# Altium schematic sheet NZPP.SchDoc
size 420 x 297 mm; SheetNumber: 1; SheetTotal: 1
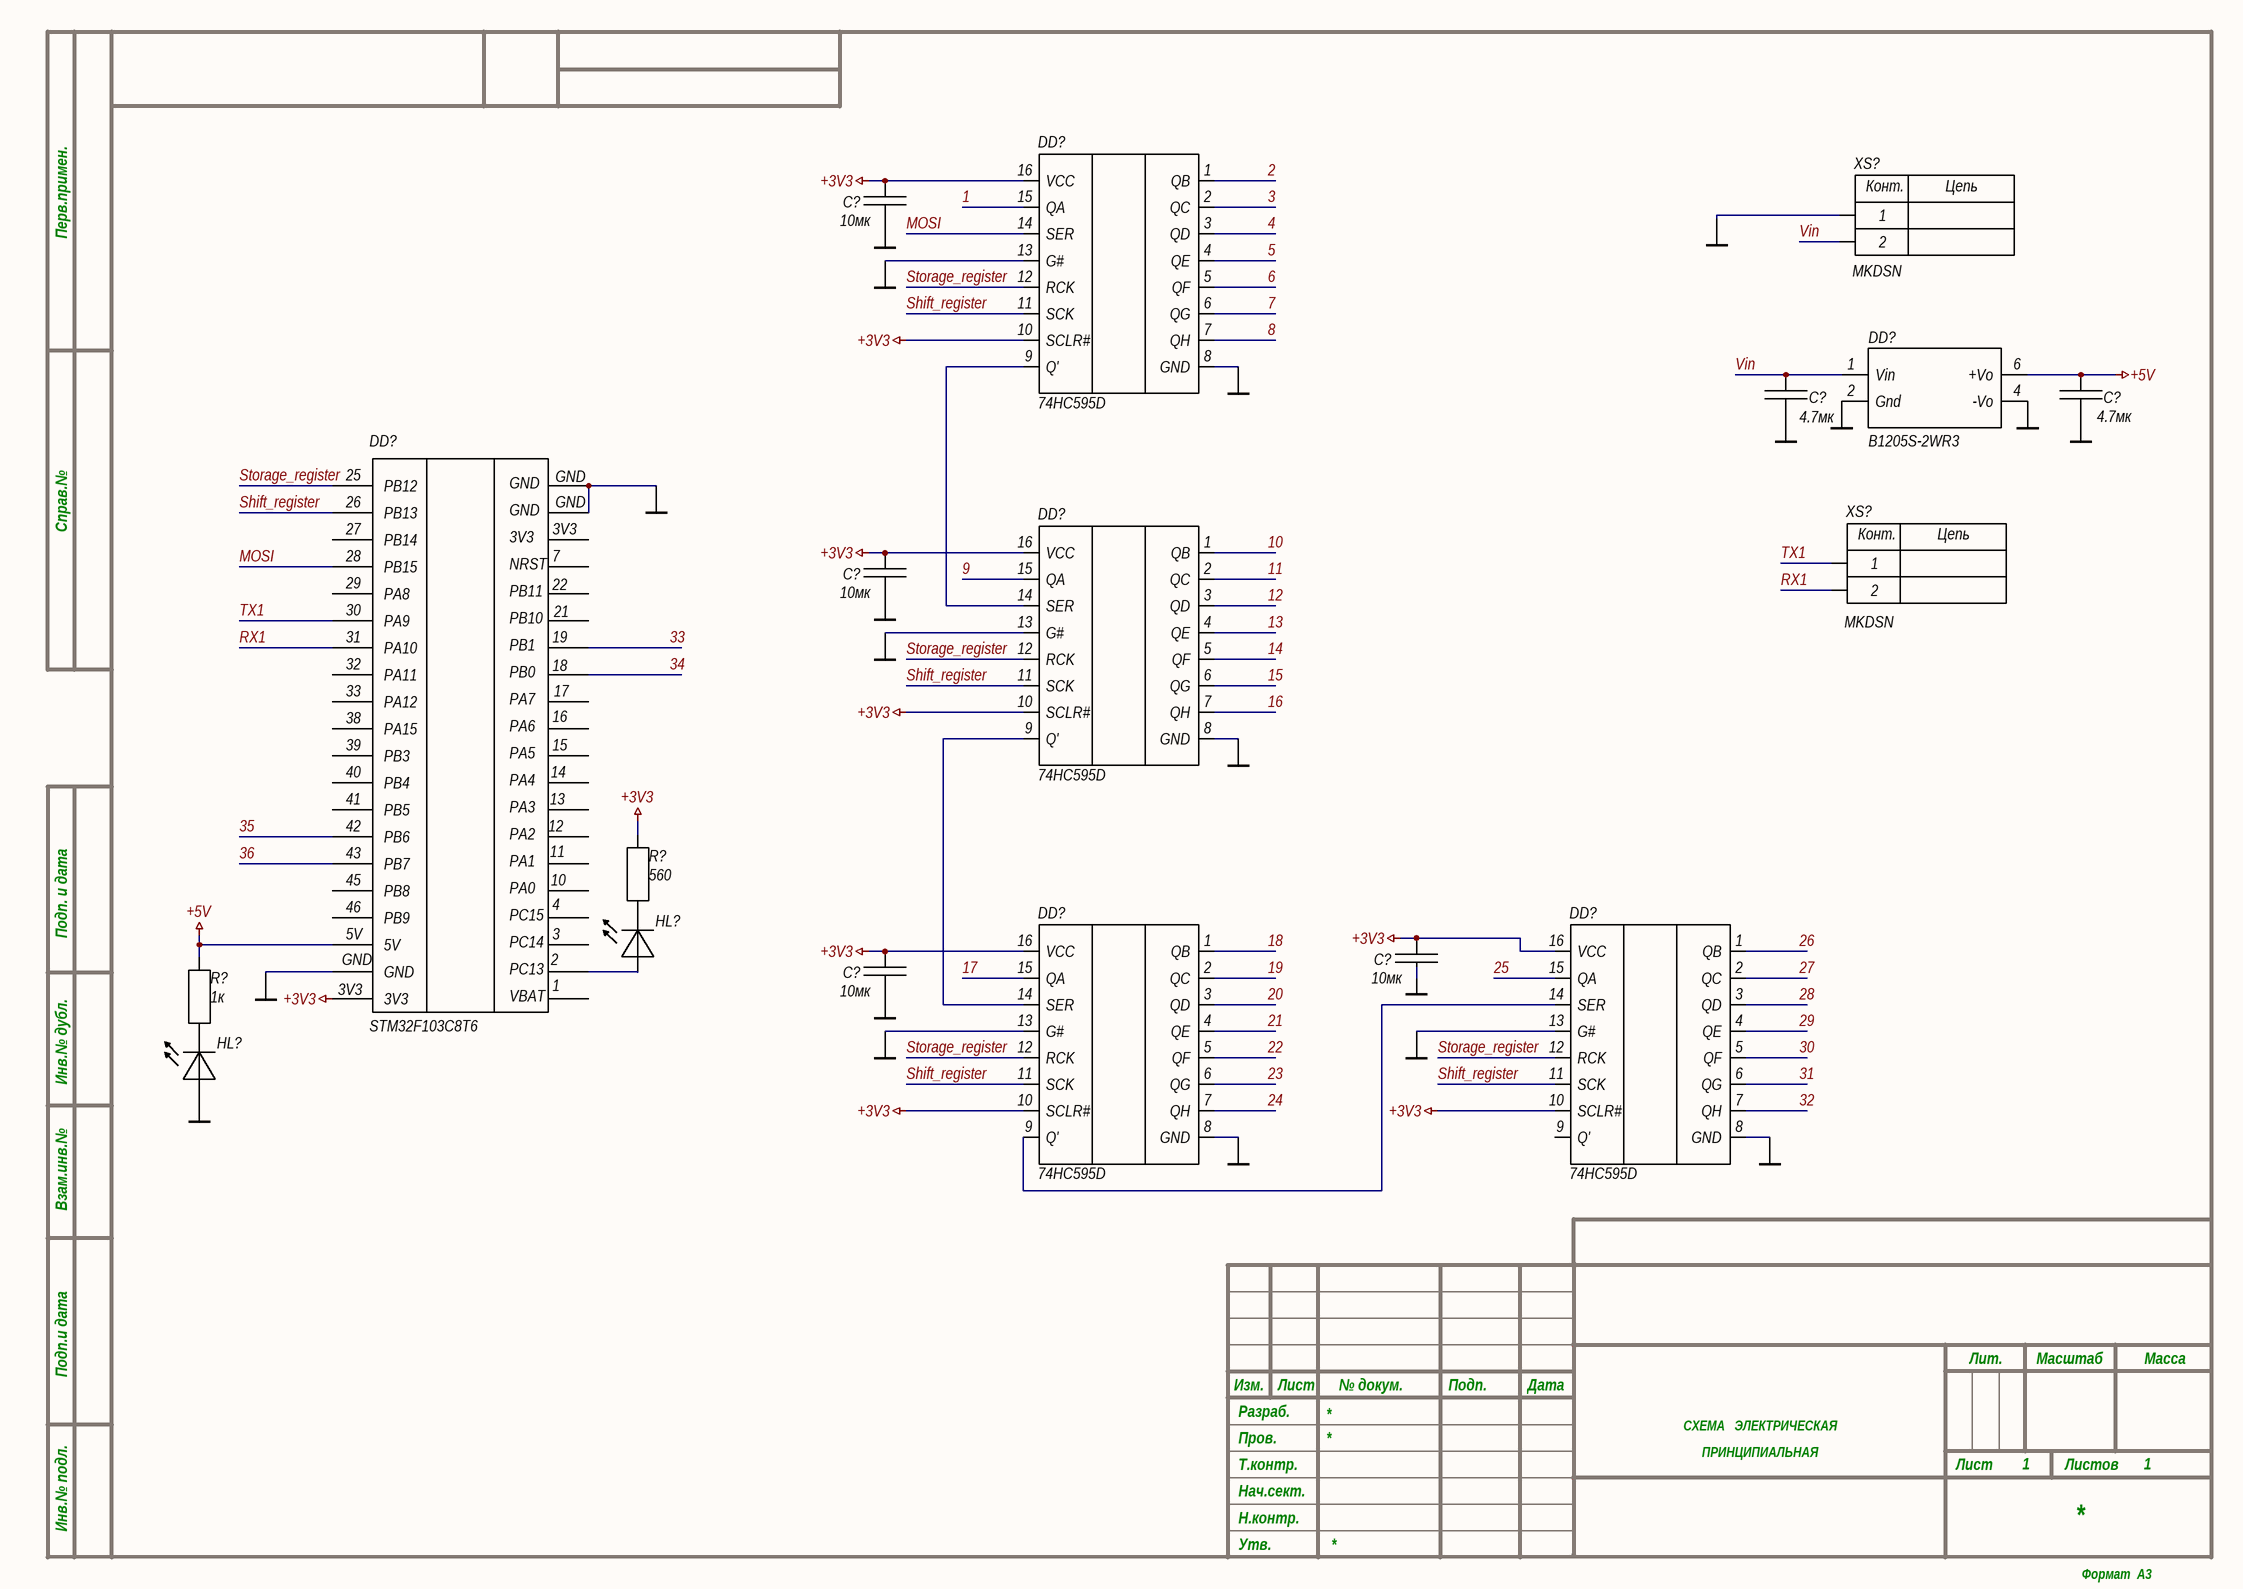
[diagram p0: NZPP.SchDoc]

## Parts
(Parts that share a designator on the sheet are numbered #1, #2 ... from top to bottom, then left to right.)
C?#1  10мк  [CAP: 0805]
C?#2  4.7мк  [CAP: 0805]
C?#3  4.7мк  [CAP: 0805]
C?#4  10мк  [CAP: 0805]
C?#5  10мк  [CAP: 0805]
C?#6  10мк  [CAP: 0805]
DD?#1  74HC595D  [74HC595D]
DD?#2  B1205S-2WR3  [B1205S-2WR3]
DD?#3  74HC595D  [74HC595D]
DD?#4  STM32F103C8T6  [STM32F103C8T6]
DD?#5  74HC595D  [74HC595D]
DD?#6  74HC595D  [74HC595D]
HL?#1  GNL-3012HD  [led]  (value not drawn)
HL?#2  GNL-3012HD  [led]  (value not drawn)
R?#1  560  [RES: 0805]
R?#2  1к  [RES: 0805]
XS?#1  MKDSN  [MKDSN 1,5/ 2-5,08]
XS?#2  MKDSN  [MKDSN 1,5/ 2-5,08]

## Nets
+3V3: C?#1.2 C?#4.2 C?#5.2 C?#6.2 DD?#1.10(SCLR#) DD?#1.16(VCC) DD?#3.10(SCLR#) DD?#3.16(VCC) DD?#4.A2(3V3) DD?#5.10(SCLR#) DD?#5.16(VCC) DD?#6.10(SCLR#) DD?#6.16(VCC) R?#1.2
+5V: C?#3.2 DD?#2.6(+Vo) DD?#4.5V R?#2.2
GND: C?#1.1 C?#2.1 C?#3.1 C?#4.1 C?#5.1 C?#6.1 DD?#1.8(GND) DD?#1.13(G#) DD?#2.2(Gnd) DD?#2.4(-Vo) DD?#3.8(GND) DD?#3.13(G#) DD?#4.GND DD?#5.8(GND) DD?#5.13(G#) DD?#6.8(GND) DD?#6.13(G#) HL?#2.1(A) XS?#1.1
1: DD?#1.15(QA)
2: DD?#1.1(QB)
3: DD?#1.2(QC)
4: DD?#1.3(QD)
5: DD?#1.4(QE)
6: DD?#1.5(QF)
7: DD?#1.6(QG)
8: DD?#1.7(QH)
9: DD?#3.15(QA)
10: DD?#3.1(QB)
11: DD?#3.2(QC)
12: DD?#3.3(QD)
13: DD?#3.4(QE)
14: DD?#3.5(QF)
15: DD?#3.6(QG)
16: DD?#3.7(QH)
17: DD?#5.15(QA)
18: DD?#5.1(QB)
19: DD?#5.2(QC)
20: DD?#5.3(QD)
21: DD?#5.4(QE)
22: DD?#5.5(QF)
23: DD?#5.6(QG)
24: DD?#5.7(QH)
25: DD?#6.15(QA)
26: DD?#6.1(QB)
27: DD?#6.2(QC)
28: DD?#6.3(QD)
29: DD?#6.4(QE)
30: DD?#6.5(QF)
31: DD?#6.6(QG)
32: DD?#6.7(QH)
33: DD?#4.19(PB1)
34: DD?#4.18(PB0)
35: DD?#4.42(PB6)
36: DD?#4.43(PB7)
MOSI: DD?#1.14(SER) DD?#4.28(PB15)
RX1: DD?#4.31(PA10) XS?#2.2
Shift_register: DD?#1.11(SCK) DD?#3.11(SCK) DD?#4.26(PB13) DD?#5.11(SCK) DD?#6.11(SCK)
Storage_register: DD?#1.12(RCK) DD?#3.12(RCK) DD?#4.25(PB12) DD?#5.12(RCK) DD?#6.12(RCK)
TX1: DD?#4.30(PA9) XS?#2.1
Vin: C?#2.2 DD?#2.1(Vin) XS?#1.2
NetDD?#1_9: DD?#1.9(Q') DD?#3.14(SER)
NetDD?#3_9: DD?#3.9(Q') DD?#5.14(SER)
NetDD?#4_2: DD?#4.2(PC13) HL?#1.1(A)
NetDD?#5_9: DD?#5.9(Q') DD?#6.14(SER)
NetHL?#1_2: HL?#1.2(C) R?#1.1
NetHL?#2_2: HL?#2.2(C) R?#2.1

Not connected (* = marked no-connect by the designer): DD?#4 1(Vbat) 3(PC14) 4(PC15) 7(NRST) 10(PA0) 11(PA1) 12(PA2) 13(PA3) 14(PA4) 15(PA5) 16(PA6) 17(PA7) 21(PB10) 22(PB11) 27(PB14) 29(PA8) 32(PA11) 33(PA12) 38(PA15) 39(PB3) 40(PB4) 41(PB5) 45(PB8) 46(PB9) A1(3V3); DD?#6 9(Q')

## Notes on the sheet
- Перв.примен.
- Справ.№
- Подп. и дата
- Инв.№ дубл.
- Взам.инв.№
- Подп.и дата
- Разраб.
- Изм.
- Лист
- № докум.
- Подп.
- Дата
- Лит.
- Масштаб
- Масса
- Т.контр.
- Пров.
- СХЕМА   ЭЛЕКТРИЧЕСКАЯ
- ПРИНЦИПИАЛЬНАЯ
- Листов
- Инв.№ подл.
- Утв.
- Н.контр.
- Нач.сект.
- Формат  A3
- (in symbol MKDSN 1,5/ 2-5,08) Конт.; Цепь
- (in symbol STM32F103) VBAT

## Library data of the parts
C?#1-C?#6 = Ceramic_0805: Наименование: 0805 10мкФ X7R 10%; Примечание: SMD
DD?#4 = STM32F103
HL?#1 HL?#2 = LED
R?#1 R?#2 = Resistor_0805: Наименование: 0805 100кОм; Примечание: SMD
XS?#1 XS?#2 = MKDSN 1,5/ 2-5,08